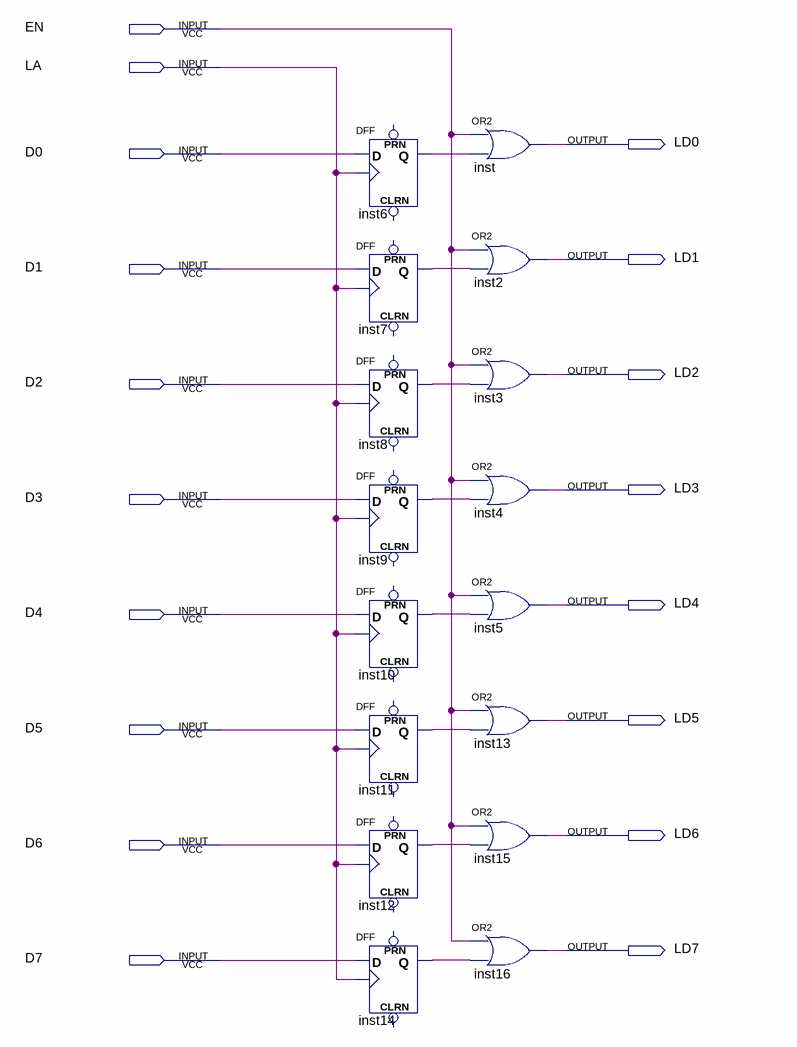
[diagram p0: schematic sheet]
// Quartus schematic 8latchedge0b.bdf as structural Verilog: 16 symbols, 18 pins
module \8latchedge0b  (
  input  EN,
  input  LA,
  input  D0,
  input  D1,
  input  D2,
  input  D3,
  input  D4,
  input  D5,
  input  D6,
  input  D7,
  output LD0,
  output LD1,
  output LD2,
  output LD3,
  output LD4,
  output LD5,
  output LD6,
  output LD7
);

  wire inst6_q, inst7_q, inst8_q, inst9_q, inst10_q, inst11_q, inst12_q, inst14_q;

  DFF inst6 (.CLK(LA), .D(D0), .Q(inst6_q));  // open: CLRN, PRN
  DFF inst7 (.CLK(LA), .D(D1), .Q(inst7_q));  // open: CLRN, PRN
  DFF inst8 (.CLK(LA), .D(D2), .Q(inst8_q));  // open: CLRN, PRN
  DFF inst9 (.CLK(LA), .D(D3), .Q(inst9_q));  // open: CLRN, PRN
  DFF inst10 (.CLK(LA), .D(D4), .Q(inst10_q));  // open: CLRN, PRN
  DFF inst11 (.CLK(LA), .D(D5), .Q(inst11_q));  // open: CLRN, PRN
  DFF inst12 (.CLK(LA), .D(D6), .Q(inst12_q));  // open: CLRN, PRN
  DFF inst14 (.CLK(LA), .D(D7), .Q(inst14_q));  // open: CLRN, PRN
  or inst (LD0, EN, inst6_q);
  or inst2 (LD1, EN, inst7_q);
  or inst3 (LD2, EN, inst8_q);
  or inst4 (LD3, EN, inst9_q);
  or inst5 (LD4, EN, inst10_q);
  or inst13 (LD5, EN, inst11_q);
  or inst15 (LD6, EN, inst12_q);
  or inst16 (LD7, EN, inst14_q);
endmodule
